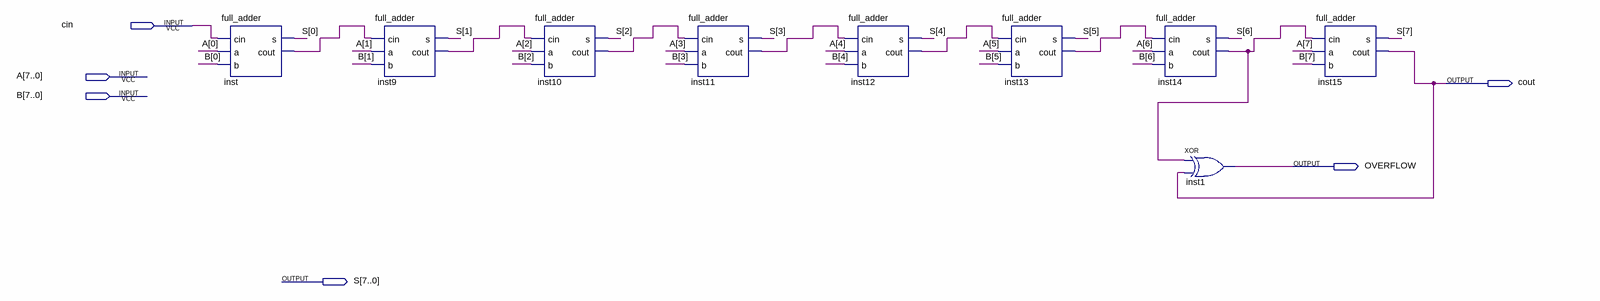
[diagram p0: schematic sheet]
// Quartus schematic adder_8_bit.bdf as structural Verilog: 9 symbols, 6 pins
module adder_8_bit (
  input  cin,
  input  [7:0] A,
  input  [7:0] B,
  output cout,
  output OVERFLOW,
  output [7:0] S
);

  wire inst9_cout, inst10_cout, inst11_cout, inst12_cout, inst13_cout, inst14_cout, inst_cout;

  full_adder inst (.cin(cin), .a(A[0]), .b(B[0]), .s(S[0]), .cout(inst_cout));
  full_adder inst9 (.cin(inst_cout), .a(A[1]), .b(B[1]), .s(S[1]), .cout(inst9_cout));
  full_adder inst10 (.cin(inst9_cout), .a(A[2]), .b(B[2]), .s(S[2]), .cout(inst10_cout));
  full_adder inst11 (.cin(inst10_cout), .a(A[3]), .b(B[3]), .s(S[3]), .cout(inst11_cout));
  full_adder inst12 (.cin(inst11_cout), .a(A[4]), .b(B[4]), .s(S[4]), .cout(inst12_cout));
  full_adder inst13 (.cin(inst12_cout), .a(A[5]), .b(B[5]), .s(S[5]), .cout(inst13_cout));
  full_adder inst14 (.cin(inst13_cout), .a(A[6]), .b(B[6]), .s(S[6]), .cout(inst14_cout));
  xor inst1 (OVERFLOW, inst14_cout, cout);
  full_adder inst15 (.cin(inst14_cout), .a(A[7]), .b(B[7]), .s(S[7]), .cout(cout));
endmodule
